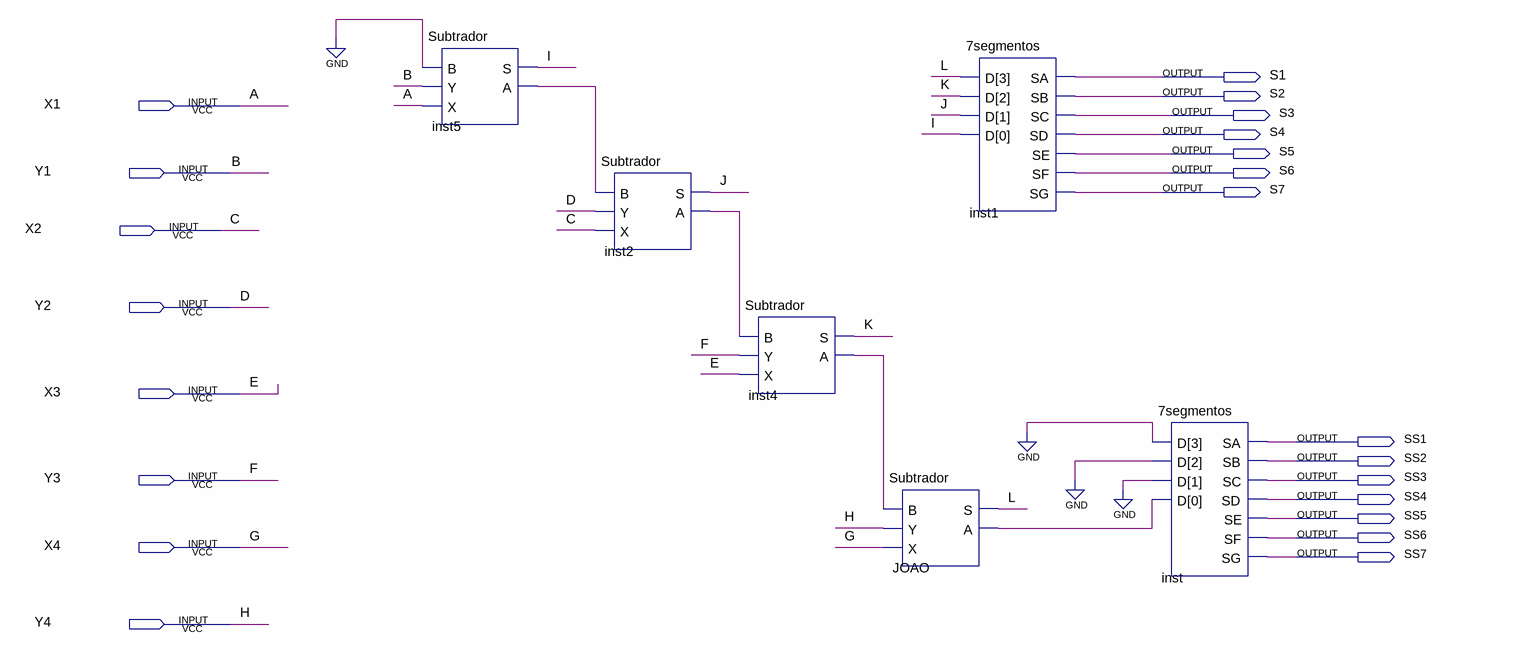
[diagram p0: schematic sheet]
// Quartus schematic palavras.bdf as structural Verilog: 6 symbols, 22 pins
module palavras (
  input  X1,
  input  Y1,
  input  X2,
  input  Y2,
  input  X3,
  input  Y3,
  input  X4,
  input  Y4,
  output S1,
  output S2,
  output S3,
  output S4,
  output S5,
  output S6,
  output S7,
  output SS1,
  output SS2,
  output SS3,
  output SS4,
  output SS5,
  output SS6,
  output SS7
);

  wire I, inst2_a, inst4_a, inst5_a, J, JOAO_a, K, L;

  Subtrador inst5 (.B(1'b0), .Y(Y1), .X(X1), .S(I), .A(inst5_a));
  Subtrador inst2 (.B(inst5_a), .Y(Y2), .X(X2), .S(J), .A(inst2_a));
  Subtrador inst4 (.B(inst2_a), .Y(Y3), .X(X3), .S(K), .A(inst4_a));
  Subtrador JOAO (.B(inst4_a), .Y(Y4), .X(X4), .S(L), .A(JOAO_a));
  \7segmentos  inst1 (.D({L, K, J, I}), .SA(S1), .SB(S2), .SC(S3), .SD(S4), .SE(S5), .SF(S6), .SG(S7));
  \7segmentos  inst (.D({3'b000, JOAO_a}), .SA(SS1), .SB(SS2), .SC(SS3), .SD(SS4), .SE(SS5), .SF(SS6), .SG(SS7));

  // Other names for the same wires on the sheet: A = X1; B = Y1; C = X2; D = Y2; E = X3; F = Y3; G = X4; H = Y4
endmodule
